# EAGLE schematic powercon_board (EAGLE 7.5.0)
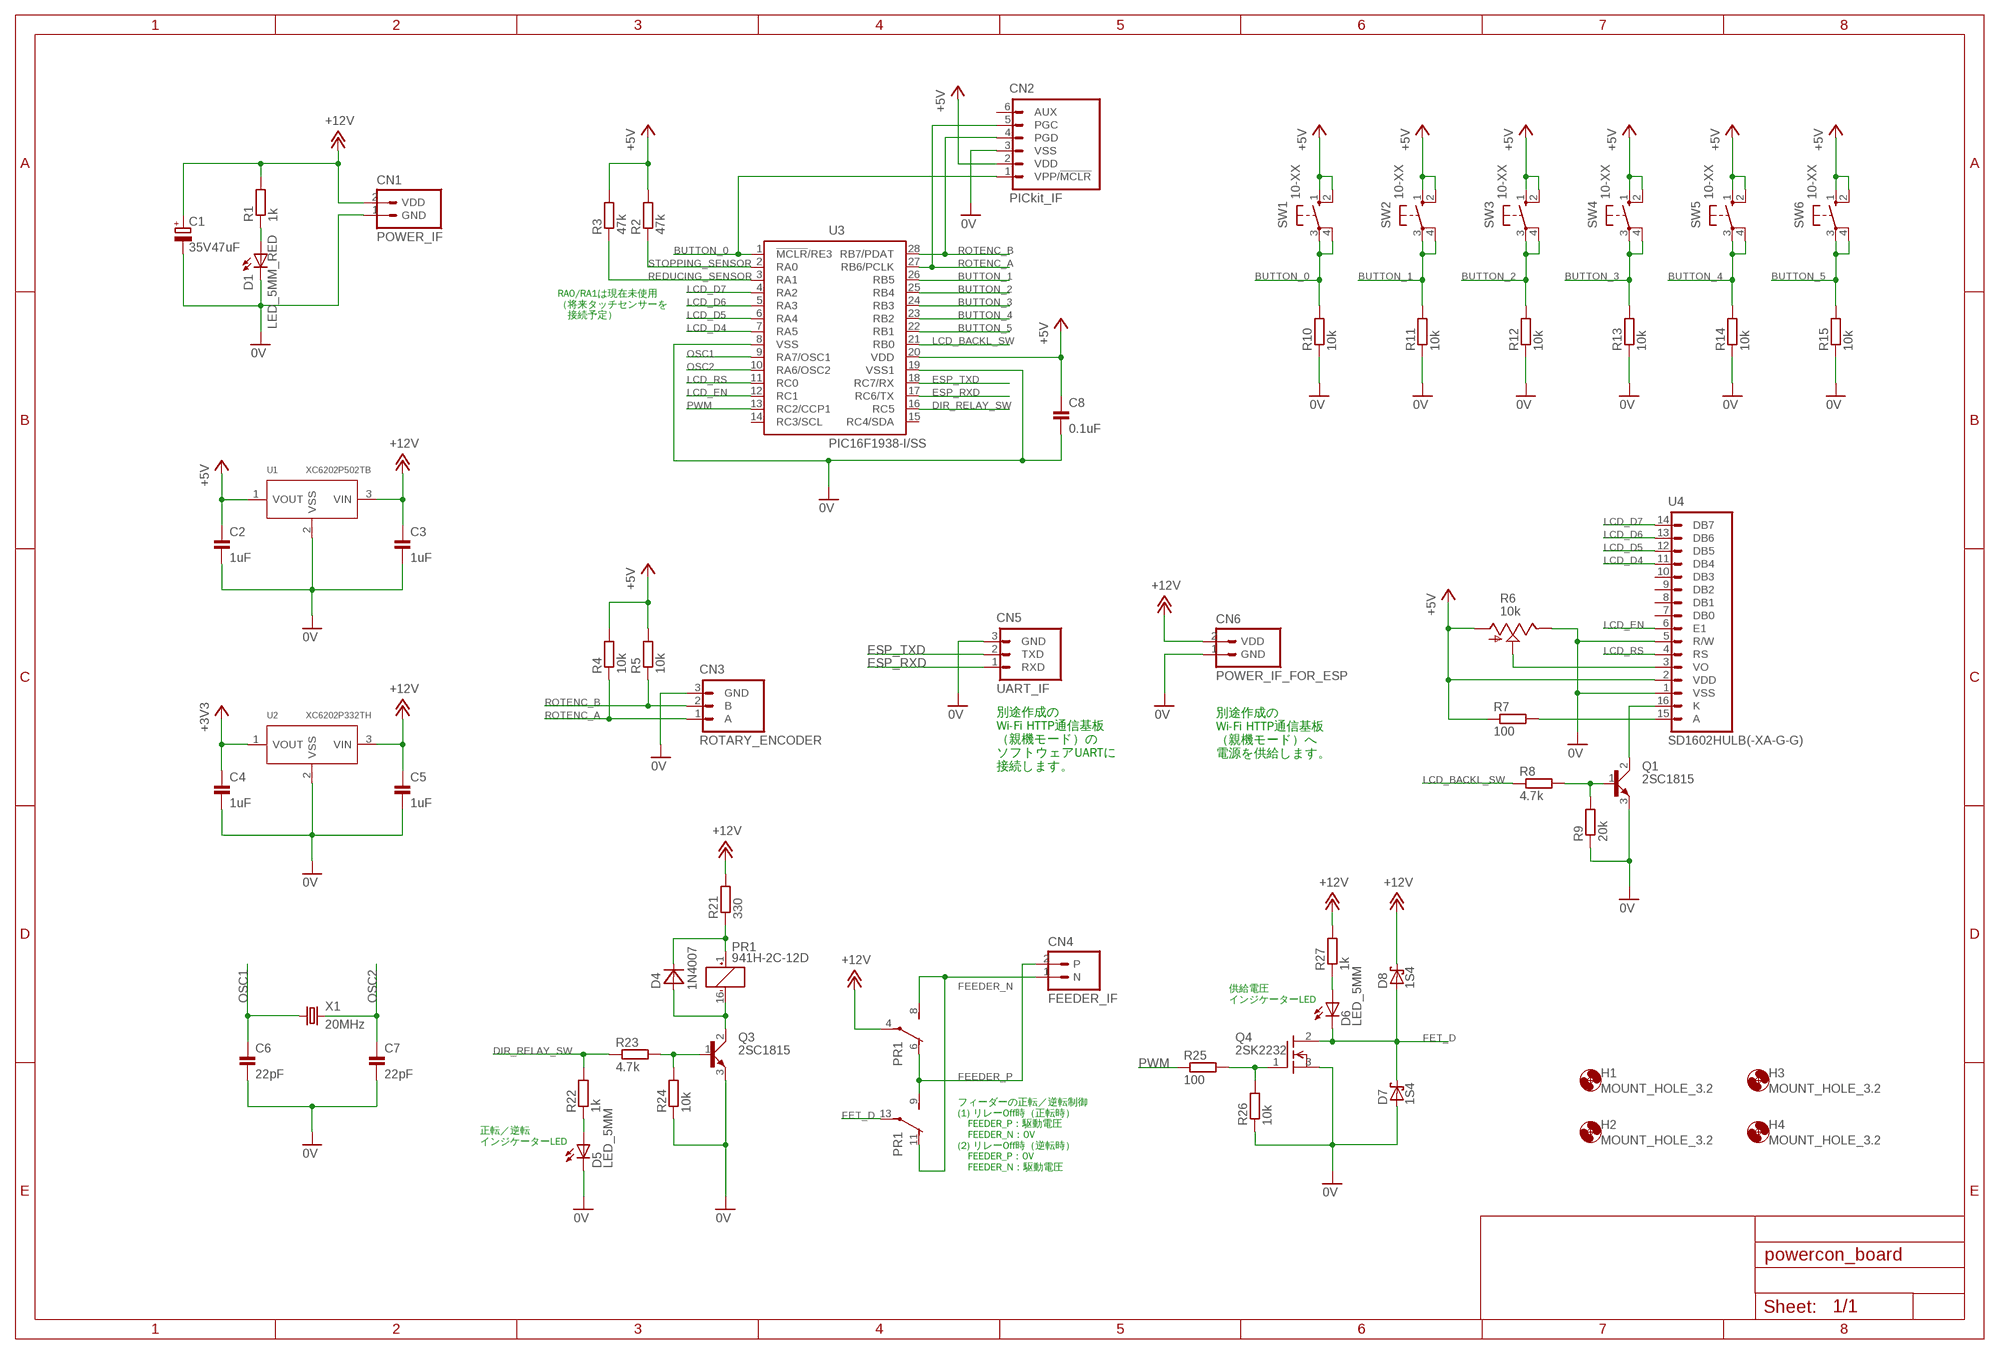
[diagram p0: schematic, sheet 1]

## Parts
C1  35V47uF  ELECAP_200MIL  [ELECAP_200MIL]
C2  1uF  CAP_200MIL  [CAP_200MIL]
C3  1uF  CAP_200MIL  [CAP_200MIL]
C4  1uF  CAP_200MIL  [CAP_200MIL]
C5  1uF  CAP_200MIL  [CAP_200MIL]
C6  22pF  CAP_200MIL  [CAP_200MIL]
C7  22pF  CAP_200MIL  [CAP_200MIL]
C8  0.1uF  CAP_200MIL  [CAP_200MIL]
CN1  POWER_IF  [HEADER_2PIN_POWER_IF]
CN2  PICkit_IF  PIC_CN_H  [HEADER_6PIN]
CN3  ROTARY_ENCODER  [HEADER_3PIN_ROT_ENC]
CN4  FEEDER_IF  [HEADER_2PIN_FEEDER_IF]
CN5  UART_IF  [HEADER_3PIN_UART_IF]
CN6  POWER_IF_FOR_ESP  POWER_IF  [HEADER_2PIN_POWER_IF]
D1  LED_5MM_RED  LED_5MM  [LED5MM]
D4  1N4007  [DIODE_300MIL]
D5  LED_5MM  [LED5MM]
D6  LED_5MM  [LED5MM]
D7  1S4  [DIODE-200MIL]
D8  1S4  [DIODE-200MIL]
H1  MOUNT_HOLE_3.2  [3,2]
H2  MOUNT_HOLE_3.2  [3,2]
H3  MOUNT_HOLE_3.2  [3,2]
H4  MOUNT_HOLE_3.2  [3,2]
PR1  941H-2C-12D  [941H-2C]
Q1  2SC1815  [TO-92NL]
Q3  2SC1815  [TO-92NL]
Q4  2SK2232  [TO-220]
R1  1k  RESISTOR_300MIL  [RESISTOR_0207_300MIL]
R2  47k  RESISTOR_300MIL  [RESISTOR_0207_300MIL]
R3  47k  RESISTOR_300MIL  [RESISTOR_0207_300MIL]
R4  10k  RESISTOR_300MIL  [RESISTOR_0207_300MIL]
R5  10k  RESISTOR_300MIL  [RESISTOR_0207_300MIL]
R6  10k  GF063XB  [GF063XB]
R7  100  RESISTOR_300MIL  [RESISTOR_0207_300MIL]
R8  4.7k  RESISTOR_300MIL  [RESISTOR_0207_300MIL]
R9  20k  RESISTOR_300MIL  [RESISTOR_0207_300MIL]
R10  10k  RESISTOR_300MIL  [RESISTOR_0207_300MIL]
R11  10k  RESISTOR_300MIL  [RESISTOR_0207_300MIL]
R12  10k  RESISTOR_300MIL  [RESISTOR_0207_300MIL]
R13  10k  RESISTOR_300MIL  [RESISTOR_0207_300MIL]
R14  10k  RESISTOR_300MIL  [RESISTOR_0207_300MIL]
R15  10k  RESISTOR_300MIL  [RESISTOR_0207_300MIL]
R21  330  RESISTOR_300MIL  [RESISTOR_0207_300MIL]
R22  1k  RESISTOR_300MIL  [RESISTOR_0207_300MIL]
R23  4.7k  RESISTOR_300MIL  [RESISTOR_0207_300MIL]
R24  10k  RESISTOR_300MIL  [RESISTOR_0207_300MIL]
R25  100  RESISTOR_300MIL  [RESISTOR_0207_300MIL]
R26  10k  RESISTOR_300MIL  [RESISTOR_0207_300MIL]
R27  1k  RESISTOR_300MIL  [RESISTOR_0207_300MIL]
SW1  10-XX  [B3F-10XX]
SW2  10-XX  [B3F-10XX]
SW3  10-XX  [B3F-10XX]
SW4  10-XX  [B3F-10XX]
SW5  10-XX  [B3F-10XX]
SW6  10-XX  [B3F-10XX]
U1  XC6202P502TB  [TO92-LINE]
U2  XC6202P332TH  [TO92-LINE]
U3  PIC16F1938-I/SS  [SSOP28]
U4  SD1602HULB(-XA-G-G)  [HEADER_16PIN_SD1602]
X1  20MHz  HUSG-20.000-20  [HC-49/S]

## Nets
0V: C1.- C2.2 C3.2 C4.2 C5.2 C6.2 C7.2 C8.2 CN1.1(GND) CN2.3(VSS) CN3.3(GND) CN5.3(GND) CN6.1(GND) D1.K(C) D5.K(C) D7.A Q1.3(E) Q3.3(E) Q4.3(S) R6.E R9.1 R10.1 R11.1 R12.1 R13.1 R14.1 R15.1 R24.1 R26.1 U1.2(VSS) U2.2(VSS) U3.8(VSS) U3.19(VSS1) U4.1(VSS) U4.5(R/W)
+3V3: C4.1 U2.1(VOUT)
+5V: C2.1 C8.1 CN2.2(VDD) R2.2 R3.2 R4.2 R5.2 R6.A R7.1 SW1.1(S) SW1.2(S1) SW2.1(S) SW2.2(S1) SW3.1(S) SW3.2(S1) SW4.1(S) SW4.2(S1) SW5.1(S) SW5.2(S1) SW6.1(S) SW6.2(S1) U1.1(VOUT) U3.20(VDD) U4.2(VDD)
+12V: C1.+ C3.1 C5.1 CN1.2(VDD) CN6.2(VDD) D8.C PR1.4(2:P) R1.2 R21.2 R27.2 U1.3(VIN) U2.3(VIN)
BUTTON_0: CN2.1(VPP/!MCLR) R10.2 SW1.3(P) SW1.4(P1) U3.1(!MCLR!/RE3)
BUTTON_1: R11.2 SW2.3(P) SW2.4(P1) U3.26(RB5)
BUTTON_2: R12.2 SW3.3(P) SW3.4(P1) U3.25(RB4)
BUTTON_3: R13.2 SW4.3(P) SW4.4(P1) U3.24(RB3)
BUTTON_4: R14.2 SW5.3(P) SW5.4(P1) U3.23(RB2)
BUTTON_5: R15.2 SW6.3(P) SW6.4(P1) U3.22(RB1)
DIR_RELAY_SW: R22.2 R23.1 U3.16(RC5)
ESP_RXD: CN5.1(RXD) U3.17(RC6/TX)
ESP_TXD: CN5.2(TXD) U3.18(RC7/RX)
FEEDER_N: CN4.1(N) PR1.8(2:S) PR1.11(3:O)
FEEDER_P: CN4.2(P) PR1.6(2:O) PR1.9(3:S)
FET_D: D6.K(C) D7.C D8.A PR1.13(3:P) Q4.2(D)
LCD_BACKL_SW: R8.1 U3.21(RB0)
LCD_D4: U3.7(RA5) U4.11(DB4)
LCD_D5: U3.6(RA4) U4.12(DB5)
LCD_D6: U3.5(RA3) U4.13(DB6)
LCD_D7: U3.4(RA2) U4.14(DB7)
LCD_EN: U3.12(RC1) U4.6(E1)
LCD_RS: U3.11(RC0) U4.4(RS)
N$1: D1.A R1.1
N$2: Q1.1(B) R8.2 R9.2
N$3: Q4.1(G) R25.2 R26.2
N$4: R6.S U4.3(VO)
N$5: Q1.2(C) U4.16(K)
N$6: R7.2 U4.15(A)
N$8: D6.A R27.1
N$13: D4.C PR1.1(1:+) R21.1
N$14: Q3.1(B) R23.2 R24.2
N$15: D4.A PR1.16(1:-) Q3.2(C)
N$16: D5.A R22.1
OSC1: C6.1 U3.9(RA7/OSC1) X1.1
OSC2: C7.1 U3.10(RA6/OSC2) X1.2
PWM: R25.1 U3.13(RC2/CCP1)
REDUCING_SENSOR: R3.1 U3.3(RA1)
ROTENC_A: CN2.5(PGC) CN3.1(A) R4.1 U3.27(RB6/PCLK)
ROTENC_B: CN2.4(PGD) CN3.2(B) R5.1 U3.28(RB7/PDAT)
STOPPING_SENSOR: R2.1 U3.2(RA0)
Unconnected: CN2.6(AUX) U3.14(RC3/SCL) U3.15(RC4/SDA) U4.7(DB0) U4.8(DB1) U4.9(DB2) U4.10(DB3)

## Notes on the sheet
- RA0/RA1は現在未使用
  （将来タッチセンサーを
  　接続予定）
- 別途作成の
  Wi-Fi HTTP通信基板
  （親機モード）へ
  電源を供給します。
- 別途作成の
  Wi-Fi HTTP通信基板
  （親機モード）の
  ソフトウェアUARTに
  接続します。
- 供給電圧
  インジケーターLED
- 正転／逆転
  インジケーターLED
- フィーダーの正転／逆転制御
  (1) リレーOff時（正転時）
  　FEEDER_P：駆動電圧
  　FEEDER_N：0V
  (2) リレーOff時（逆転時）
  　FEEDER_P：0V
  　FEEDER_N：駆動電圧

## Library data of the parts
C1 = Parts:ELECAP: 電解コンデンサー
C2-C8 = Parts:CAP: コンデンサー
CN1 CN6 = PartsForProto:POWER_IF: 電源供給インターフェース
CN2 = Connectors:PIC_CN: PICKit 3 インターフェースピン
CN3 = PartsForProto:ROTARY_ENCODER: ロータリーエンコーダ RE160F-40E3-20A-24P ・１回転２４パルス出力（各相） ■定格電圧：ＤＣ５Ｖ ■最大電流（抵抗負荷）： 両端の端子：０．５ｍＡ 共通の端子：１．０ｍＡ
CN4 = PartsForProto:FEEDER_IF: フィーダー接続用端子
CN5 = PartsForProto:UART_IF: UARTインターフェース pin1：PCまたはPICからの入力 pin2：PCまたはPICへの出力 pin3：GND
D1 D5 D6 = Parts:LED: 発光ダイオード
D4 = Parts:1N4007: 一般整流用ダイオード ■１０００Ｖ１Ａ ■ＶＦ：１．１Ｖ（１Ａ時）
D7 D8 = Parts:1S4: 整流用ショットキーダイオード ・ＶRR(ピーク繰り返し逆電圧)：４０Ｖ ・ＩＦ(平均順電流)：１．０Ａ ・ＶＦ(ピーク順電圧)：０．５Ｖ（１Ａ時）
H1-H4 = Generic:MOUNT_HOLE
PR1 = Parts:941H-2C-*: HSIN DA 941 Series Relay
Q1 Q3 = Parts:2SC1815: 汎用トランジスタ 東芝２ＳＣ１８１５のセカンドソース品です。 ・高耐圧でしかも電流容量が大きい。 ：ＶＣＥＯ＝５０Ｖ（最小）、ＩＣ＝１５０ｍＡ（最大） ・電流増幅率の電流依存特性が優れています。 ：ＮＦ＝１．０ｄＢ（標準）（ｆ＝１００Ｈｚ） ※型番のＬはローノイズではなく、鉛フリーを表しています。
Q4 = Parts:2SK2232: ＮチャンネルパワーＭＯＳＦＥＴ ■リレー駆動、ＤＣ－ＤＣコンバータ向け、モータドライブ用 ・耐圧（ＶＤＳＳ）：６０Ｖ ・ＩＤ＝２５Ａ パルス：１００Ａ ・低オン抵抗：ＲＤＳ＝３６ｍΩ ・ＰＤ：３５Ｗ ・Ｖｔｈ＝０．８～２．０Ｖ（ＶＤＳ＝１０Ｖ、ＩＤ＝１ｍＡ） ・スイッチングスピード：ｔｆ＝５５ｎｓ
R1-R5 R7-R15 R21-R27 = Parts:RESISTOR: 抵抗器
R6 = Parts:GF063XB: 単回転型サーメットトリマ
SW1-SW6 = Parts:10-XX: TACT SWITCH
U1 U2 = Parts:XC6202*: 低損失ＣＭＯＳ三端子レギュレーター ・定格出力：５Ｖ ・最大出力電流：１５０ｍＡ以上 ・入力最大電圧：２０Ｖ ・入出力電圧差： ０．２Ｖ（３０ｍＡ時） ０．６７Ｖ（１００ｍＡ時） ・低消費電流：１０μＡ
U3 = Parts:PIC16F1938*: 28-Pin フラッシュ マイクロコントローラ ■プログラムメモリサイズ : 28K words ■EEPROMサイズ : 256 bytes ■RAMサイズ : 1K bytes ■I/O数 : 25 ■電圧 - 電源 : 1.8-5.5V ■動作温度 : -40°C～85°C
U4 = PartsForProto:SD1602HULB(-XA-G-G): LCDモジュール ピッチ変換キット Ｉ２Ｃ接続小型キャラクタＬＣＤモジュール AE-AQM1602A ◆６６ｍｍ×２７．７ｍｍ２．０ｍｍ （画面５４．７ｍｍｘ１０．８ｍｍ） ◆電源電圧は３．１～５．５Ｖ ◆低消費電流です：１ｍＡ＠３．３Ｖ
X1 = Parts:HUSG-*: クリスタル（水晶発振子） 小型のＨＣ－４９／Ｓ型パッケージです。 ・２０ＭＨｚ ・負荷容量：２０ｐＦ ・周波数偏差：±３０ｐｐｍ（２５℃）